# Altium schematic sheet RAM_SDR_BGA54.SchDoc
size A3; SheetNumber: 12; SheetTotal: 22
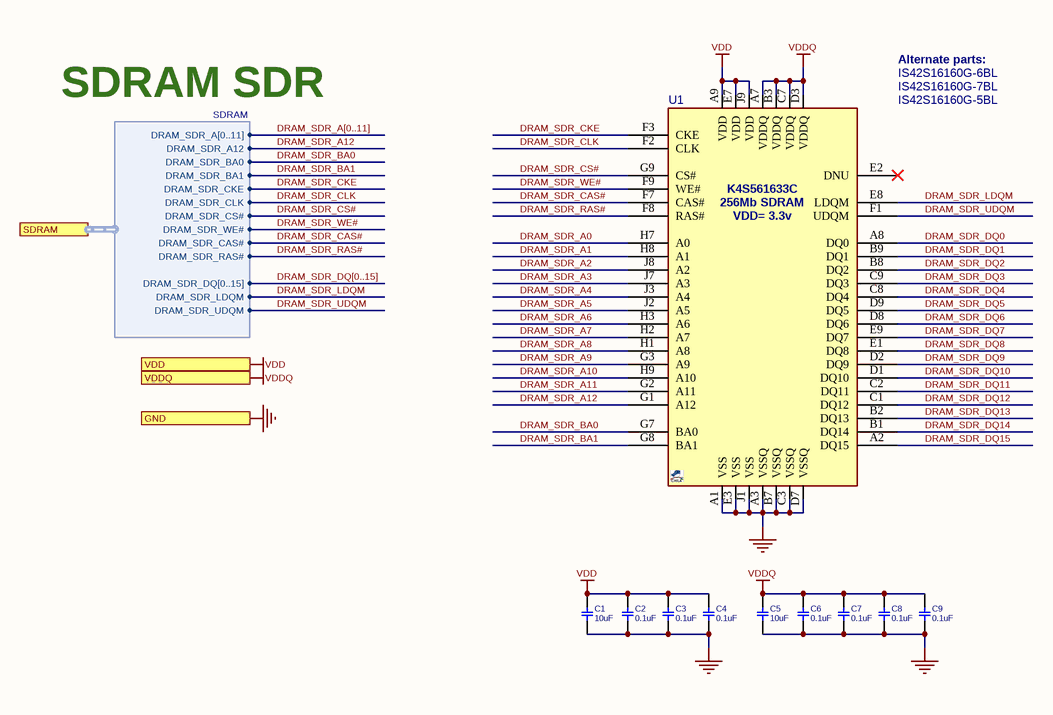
[diagram p0: RAM_SDR_BGA54.SchDoc]

## Parts
C1  10uF  [C0402A]
C2  0.1uF  [C0402A]
C3  0.1uF  [C0402A]
C4  0.1uF  [C0402A]
C5  10uF  [C0402A]
C6  0.1uF  [C0402A]
C7  0.1uF  [C0402A]
C8  0.1uF  [C0402A]
C9  0.1uF  [C0402A]
U1  K4S561633C  [BGA80_54_8X8]  (value not drawn)

## Ports
GND, SDRAM (harness SDRAM), VDD, VDDQ

## Harnesses
SDRAM: DRAM_SDR_A[0..11], DRAM_SDR_BA0, DRAM_SDR_CKE, DRAM_SDR_CLK, DRAM_SDR_CS#, DRAM_SDR_WE#, DRAM_SDR_CAS#, DRAM_SDR_RAS#, DRAM_SDR_DQ[0..15], DRAM_SDR_LDQM, DRAM_SDR_UDQM, DRAM_SDR_A12, DRAM_SDR_BA1

## Nets
GND: C1.1 C2.1 C3.1 C4.1 C5.1 C6.1 C7.1 C8.1 C9.1 U1.A1(VSS) U1.A3(VSSQ) U1.B7(VSSQ) U1.C3(VSSQ) U1.D7(VSSQ) U1.E3(VSS) U1.J1(VSS) ; port GND
VDD: C1.2 C2.2 C3.2 C4.2 U1.A9(VDD) U1.E7(VDD) U1.J9(VDD) ; port VDD
VDDQ: C5.2 C6.2 C7.2 C8.2 C9.2 U1.A7(VDDQ) U1.B3(VDDQ) U1.C7(VDDQ) U1.D3(VDDQ) ; port VDDQ
DRAM_SDR_A0: U1.H7(A0)
DRAM_SDR_A1: U1.H8(A1)
DRAM_SDR_A2: U1.J8(A2)
DRAM_SDR_A3: U1.J7(A3)
DRAM_SDR_A4: U1.J3(A4)
DRAM_SDR_A5: U1.J2(A5)
DRAM_SDR_A6: U1.H3(A6)
DRAM_SDR_A7: U1.H2(A7)
DRAM_SDR_A8: U1.H1(A8)
DRAM_SDR_A9: U1.G3(A9)
DRAM_SDR_A10: U1.H9(A10)
DRAM_SDR_A11: U1.G2(A11)
DRAM_SDR_A12: U1.G1(A12) ; port SDRAM.DRAM_SDR_A12
DRAM_SDR_BA0: U1.G7(BA0) ; port SDRAM.DRAM_SDR_BA0
DRAM_SDR_BA1: U1.G8(BA1) ; port SDRAM.DRAM_SDR_BA1
DRAM_SDR_CAS#: U1.F7(CAS#) ; port SDRAM.DRAM_SDR_CAS#
DRAM_SDR_CKE: U1.F3(CKE) ; port SDRAM.DRAM_SDR_CKE
DRAM_SDR_CLK: U1.F2(CLK) ; port SDRAM.DRAM_SDR_CLK
DRAM_SDR_CS#: U1.G9(CS#) ; port SDRAM.DRAM_SDR_CS#
DRAM_SDR_DQ0: U1.A8(DQ0)
DRAM_SDR_DQ1: U1.B9(DQ1)
DRAM_SDR_DQ2: U1.B8(DQ2)
DRAM_SDR_DQ3: U1.C9(DQ3)
DRAM_SDR_DQ4: U1.C8(DQ4)
DRAM_SDR_DQ5: U1.D9(DQ5)
DRAM_SDR_DQ6: U1.D8(DQ6)
DRAM_SDR_DQ7: U1.E9(DQ7)
DRAM_SDR_DQ8: U1.E1(DQ8)
DRAM_SDR_DQ9: U1.D2(DQ9)
DRAM_SDR_DQ10: U1.D1(DQ10)
DRAM_SDR_DQ11: U1.C2(DQ11)
DRAM_SDR_DQ12: U1.C1(DQ12)
DRAM_SDR_DQ13: U1.B2(DQ13)
DRAM_SDR_DQ14: U1.B1(DQ14)
DRAM_SDR_DQ15: U1.A2(DQ15)
DRAM_SDR_LDQM: U1.E8(LDQM) ; port SDRAM.DRAM_SDR_LDQM
DRAM_SDR_RAS#: U1.F8(RAS#) ; port SDRAM.DRAM_SDR_RAS#
DRAM_SDR_UDQM: U1.F1(UDQM) ; port SDRAM.DRAM_SDR_UDQM
DRAM_SDR_WE#: U1.F9(WE#) ; port SDRAM.DRAM_SDR_WE#

Not connected (* = marked no-connect by the designer): U1 E2(DNU)*

## Buses and harness runs
bus DRAM_SDR_A[0..11]
bus DRAM_SDR_DQ[0..15]

## Notes on the sheet
- Alternate parts:
- SDRAM SDR
- (near U1) IS42S16160G-5BL
- (near U1) IS42S16160G-6BL
- (near U1) IS42S16160G-7BL
- (in symbol SDRAM_K4S561633C_BGA54) 256Mb SDRAM; VDD= 3.3v

## Library data of the parts
C1 C5 = CAP_SMD_MLCC: CAP, MLCC; PARAM: X5R, 20%; MANF_P#: CL05A106MP5NUNC; MANF: Samsung; PRICE: 100= 1$; PARAM2: -; ASSEMBLY: ASSEMBLY; VALUE: 10uF
C2-C4 C6-C9 = CAP_SMD_MLCC: CAP, MLCC; PARAM: X5R, 10%; MANF_P#: GRM155R61E104; MANF: Murata; PARAM2: 25v; PRICE: 10,000:$0.006; ASSEMBLY: ASSEMBLY; VALUE: 0.1uF
U1 = SDRAM_K4S561633C_BGA54: SDRAM, 256Mb(4MbX16bX4), BGA-54; MANF: ISSI; MANF_P#: K4S561633C-RL75; PARAM2: LVCMOS 3.3V; PARAM: 256Mb(4MbX16bX4), -25~70°C; VALUE: K4S561633C